# Altium project Thermograph_PT100.PrjPcb
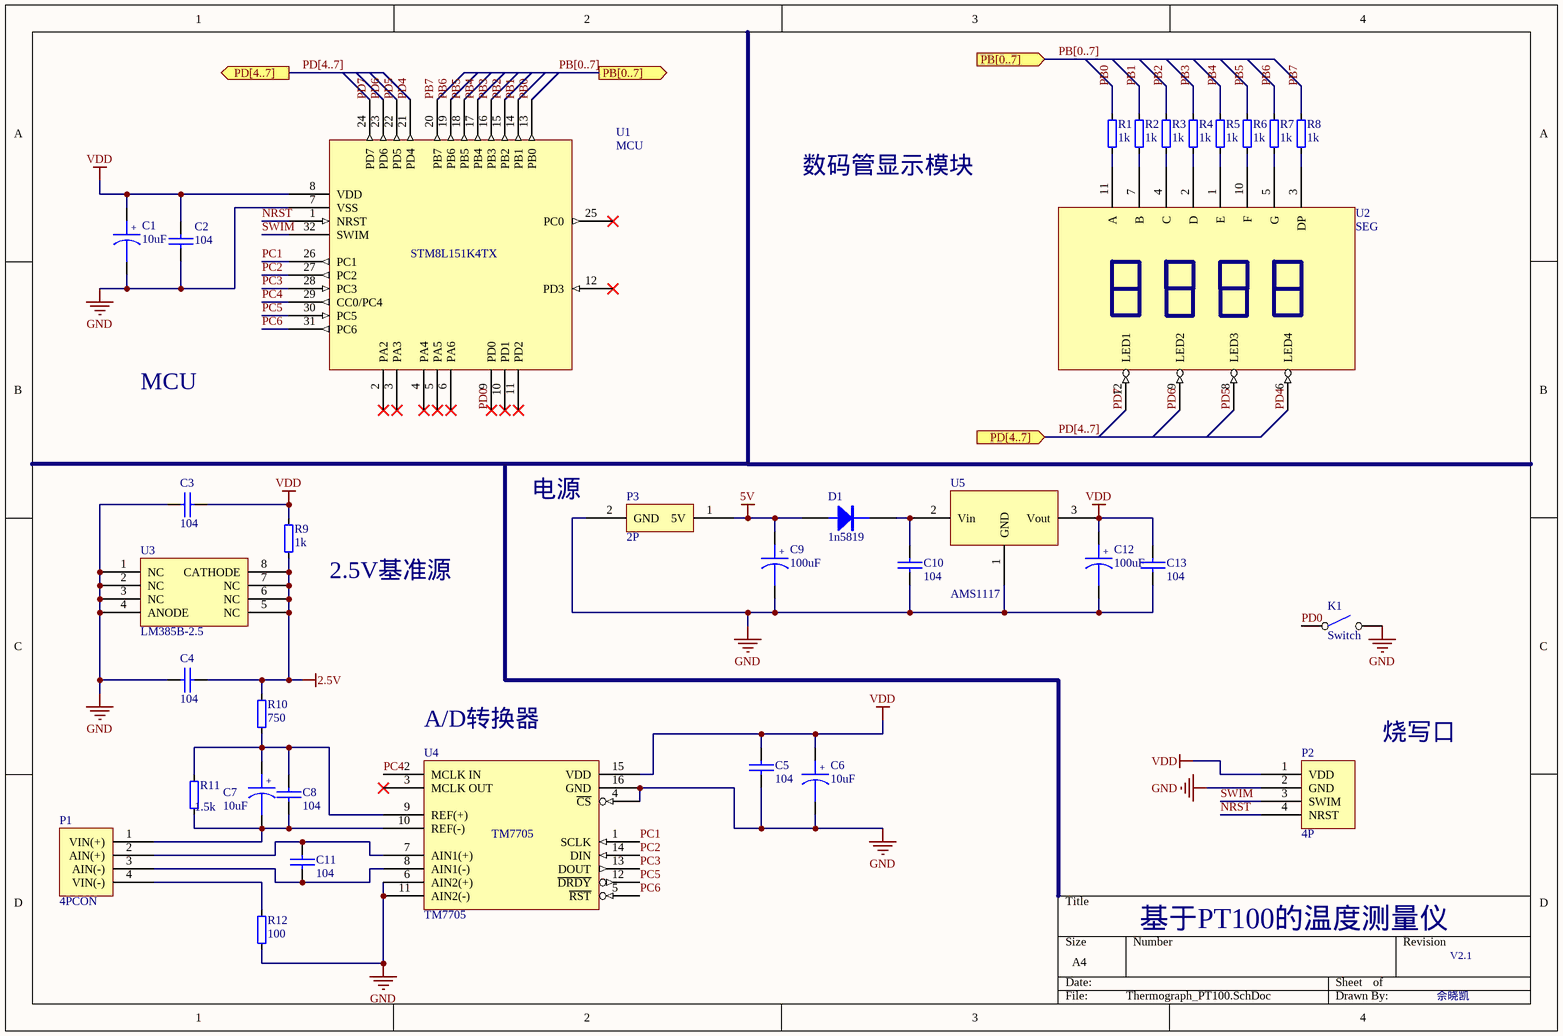
[diagram p0: Thermograph_PT100.SchDoc]
1 sheet, 35 parts. Net scope: flat (ports and power ports of the same name join across sheets).
Board file: Thermograph_PT100.PcbDoc

## Sheet Thermograph_PT100.SchDoc
size A4; Date: 2018/4/12; ApprovedBy: 佘晓凯，刘亚林; Author: 佘晓凯; CompanyName: 绍兴文理学院; DrawnBy: 佘晓凯; DocumentNumber: V1.0; PageSetup: Record=PageOptions|CenterHorizontal=True|CenterVertical=True|PrintScale=1.00|XCorrection=1.00|YCorrection=1.00|PrintKind=0|BorderSize=5000000|LeftOffset=0|BottomOffset=0|Orientation=2|PaperLength=1000|PaperWidth=1000|Scale=100|PaperSource=7|PrintQuality=-3|MediaType=1|DitherType=10|PrintScaleMode=1|PaperKind=A4|PaperIndex=9; CurrentTime: 17:40; CurrentDate: 2018/04/12; DocumentName: 基于PT100的温度测量仪; Application_BuildNumber: V1.0

### Parts
C1  10uF  [cap2]
C2  104  [cap1]
C3  104  [cap1]
C4  104  [cap1]
C5  104  [cap1]
C6  10uF  [cap2]
C7  10uF  [cap2]
C8  104  [cap1]
C9  100uF  [cap2]
C10  104  [cap1]
C11  104  [cap1]
C12  100uF  [cap2]
C13  104  [cap1]
D1  1n5819  [1N4007]
K1  Switch  [Switch1]
P1  4PCON  [4P1]
P2  4P  [4P2]
P3  2P  [2PXH]
R1  1k  [RES]
R2  1k  [RES]
R3  1k  [RES]
R4  1k  [RES]
R5  1k  [RES]
R6  1k  [RES]
R7  1k  [RES]
R8  1k  [RES]
R9  1k  [RES]
R10  750  [RES]
R11  1.5k  [RES]
R12  100  [RES]
U1  MCU  [STM8L151K4TX]
U2  SEG  [SEG]
U3  LM385B-2.5  [LM385B-2.5]
U4  TM7705  [TM7705]
U5  AMS1117  [AMS1117-3.3]

### Ports
PB[0..7] (in), PB[0..7] (out), PD[4..7] (in), PD[4..7] (out)

### Nets
2.5V: C4.2 R9.1 R10.1 U3.5(NC) U3.6(NC) U3.7(NC) U3.8(CATHODE)
5V: C9.A D1.A P3.1(5V)
GND: C1.K C2.1 C3.1 C4.1 C5.1 C6.K C9.K C10.1 C12.K C13.1 K1.2 P2.2(GND) P3.2(GND) R12.2 U1.7(VSS) U3.1(NC) U3.2(NC) U3.3(NC) U3.4(ANODE) U4.4(~{CS}) U4.6(AIN2(+)) U4.11(AIN2(-)) U4.16(GND) U5.1(GND)
VDD: C1.A C2.2 C3.2 C5.2 C6.A C12.A C13.2 P2.1(VDD) R9.2 U1.8(VDD) U4.15(VDD) U5.3(Vout)
NRST: P2.4(NRST) U1.1(NRST)
PB0: R1.2 U1.13(PB0)
PB1: R2.2 U1.14(PB1)
PB2: R3.2 U1.15(PB2)
PB3: R4.2 U1.16(PB3)
PB4: R5.2 U1.17(PB4)
PB5: R6.2 U1.18(PB5)
PB6: R7.2 U1.19(PB6)
PB7: R8.2 U1.20(PB7)
PC1: U1.26(PC1) U4.1(SCLK)
PC2: U1.27(PC2) U4.14(DIN)
PC3: U1.28(PC3) U4.13(DOUT)
PC4: U1.29(CC0/PC4) U4.2(MCLK_IN)
PC5: U1.30(PC5) U4.12(~{DRDY})
PC6: U1.31(PC6) U4.5(~{RST})
PD0: K1.1 U1.9(PD0)
PD4: U1.21(PD4) U2.6(LED4)
PD5: U1.22(PD5) U2.8(LED3)
PD6: U1.23(PD6) U2.9(LED2)
PD7: U1.24(PD7) U2.12(LED1)
SWIM: P2.3(SWIM) U1.32(SWIM)
NetC7_A: C7.A C8.2 R10.2 R11.2 U4.9(REF(+))
NetC7_K: C7.K C8.1 P1.1(VIN(+)) R11.1 U4.10(REF(-))
NetC10_2: C10.2 D1.K U5.2(Vin)
NetC11_1: C11.1 P1.3(AIN(-)) U4.8(AIN1(-))
NetC11_2: C11.2 P1.2(AIN(+)) U4.7(AIN1(+))
NetP1_4: P1.4(VIN(-)) R12.1
NetR1_1: R1.1 U2.11(A)
NetR2_1: R2.1 U2.7(B)
NetR3_1: R3.1 U2.4(C)
NetR4_1: R4.1 U2.2(D)
NetR5_1: R5.1 U2.1(E)
NetR6_1: R6.1 U2.10(F)
NetR7_1: R7.1 U2.5(G)
NetR8_1: R8.1 U2.3(DP)

Not connected (* = marked no-connect by the designer): U1 2(PA2)* 3(PA3)* 4(PA4)* 5(PA5)* 6(PA6)* 10(PD1)* 11(PD2)* 12(PD3)* 25(PC0)*; U4 3(MCLK_OUT)*

### Buses and harness runs
bus PB[0..7] = port PB[0..7]
bus PD[4..7] = port PD[4..7]

### Notes on the sheet
- 数码管显示模块
- MCU
- 电源
- (near R9) 2.5V基准源
- (near U4) A/D转换器
- 烧写口
- 基于PT100的温度测量仪
- V2.1
- 佘晓凯
- (in symbol Cap2) +

### Library data of the parts
C1 C6 C7 C9 C12 = Cap2: 电解电容
C2-C5 C8 C10 C11 C13 = Cap1: 无极性电容
D1 = 1N4007
K1 = Switch: 开关
P1 = 4PCON: 4P端口
P3 = 2P: 5V电源
R1-R12 = Res: 电阻
U1 = STM8L151K4TX: STM8MCU
U2 = 数码管
U3 = LM385B-2.5: 2.5V稳压芯片